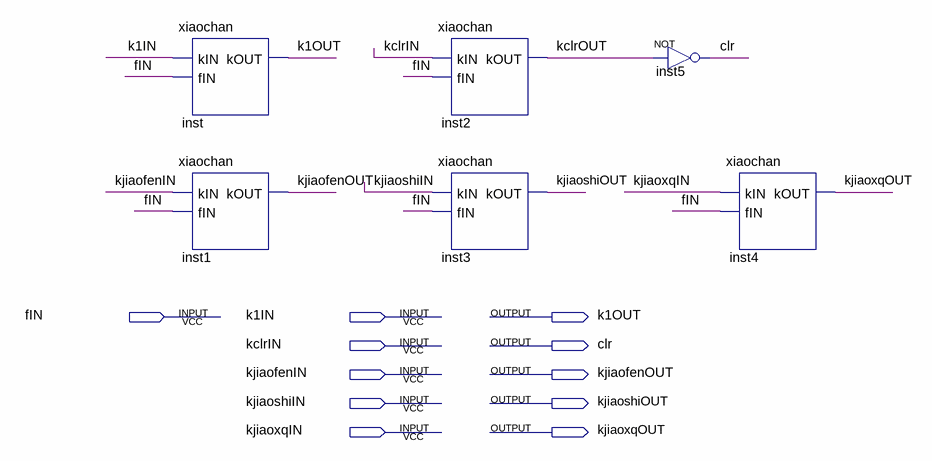
[diagram p0: schematic sheet]
// Quartus schematic xiaochanjihe.bdf as structural Verilog: 6 symbols, 11 pins
module xiaochanjihe (
  input  fIN,
  input  k1IN,
  input  kclrIN,
  input  kjiaofenIN,
  input  kjiaoshiIN,
  input  kjiaoxqIN,
  output k1OUT,
  output clr,
  output kjiaofenOUT,
  output kjiaoshiOUT,
  output kjiaoxqOUT
);

  wire kclrOUT;

  xiaochan inst (.kIN(k1IN), .fIN(fIN), .kOUT(k1OUT));
  xiaochan inst1 (.kIN(kjiaofenIN), .fIN(fIN), .kOUT(kjiaofenOUT));
  xiaochan inst2 (.kIN(kclrIN), .fIN(fIN), .kOUT(kclrOUT));
  xiaochan inst3 (.kIN(kjiaoshiIN), .fIN(fIN), .kOUT(kjiaoshiOUT));
  not inst5 (clr, kclrOUT);
  xiaochan inst4 (.kIN(kjiaoxqIN), .fIN(fIN), .kOUT(kjiaoxqOUT));
endmodule
